# Altium schematic sheet EFR32xG27_BLE_AGR_REF_DES_A00_Sheet2.SchDoc
size 420 x 297 mm
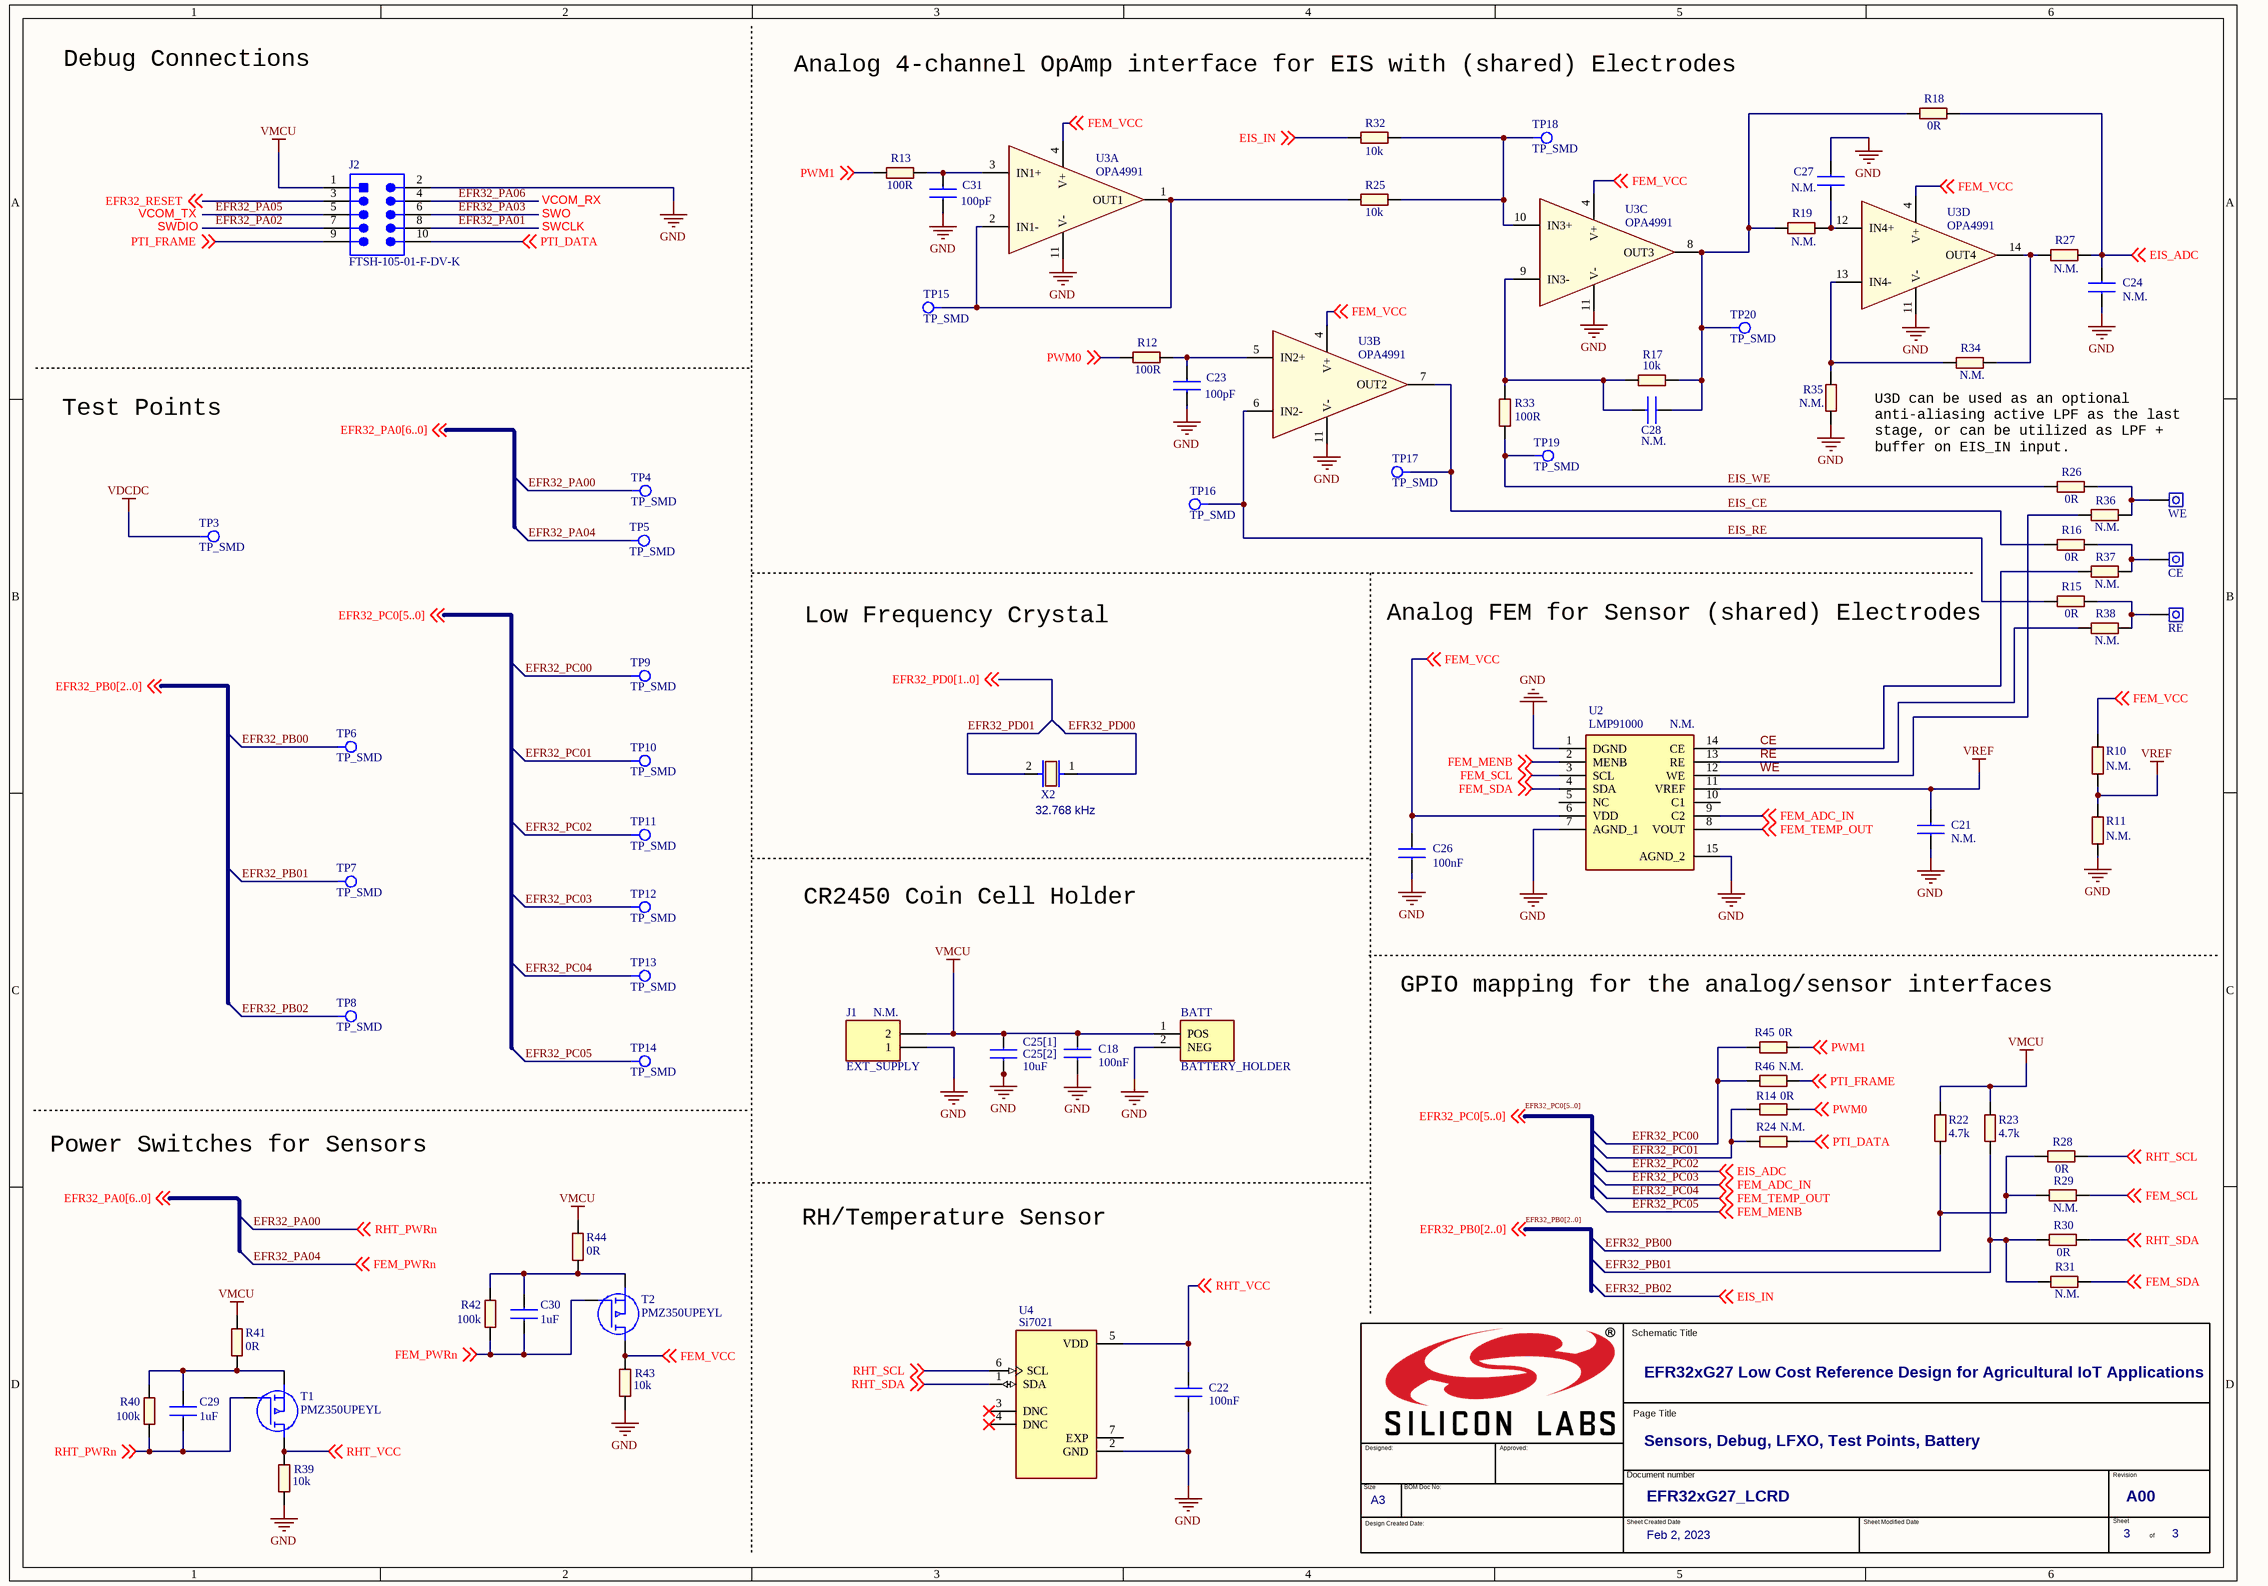
[diagram p0: EFR32xG27_BLE_AGR_REF_DES_A00_Sheet2.SchDoc]

## Parts
*?  Page Title: Sensors, Debug, LFXO, Test Points, Battery  Page Size: A3  Title: EFR32xG27 Low Cost Reference Design for Agricultural IoT Applications  Page Number: 3  (hidden comment: TitleBlock_EnergyMicro_A3)  (graphical)
BATT  BATTERY_HOLDER  [Battery_holder_CR2450_SMT_1052]
C18  value 100nF  [0201]
C21  Not Mounted: N.M.  [0201]
C22  value 100nF  [0201]
C23  value 100pF  [0201]
C24  Not Mounted: N.M.  [0201]
C25[1]  value 10uF  [C_0402]
C25[2]  (no value)  [C_0603]
C26  value 100nF  [0201]
C27  Not Mounted: N.M.  [0201]
C28  Not Mounted: N.M.  [0201]
C29  value 1uF  [C_0402]
C30  value 1uF  [C_0402]
C31  value 100pF  [0201]
CE  Sensor Electrode  [Sensor Electrode]  (value not drawn)
J1  EXT_SUPPLY  Not Mounted: N.M.  [Jumper_HDR_2.54mm]
J2  FTSH-105-01-F-DV-K  [SMTC-FTSH-105-01-L-DV-K_V]
R10  Not Mounted: N.M.  [0201]
R11  Not Mounted: N.M.  [0201]
R12  value 100R  [0201]
R13  value 100R  [0201]
R14  value 0R  [0201]
R15  value 0R  [0201]
R16  value 0R  [0201]
R17  value 10k  [0201]
R18  value 0R  [0201]
R19  Not Mounted: N.M.  [0201]
R22  value 4.7k  [0201]
R23  value 4.7k  [0201]
R24  Not Mounted: N.M.  [0201]
R25  value 10k  [0201]
R26  value 0R  [0201]
R27  Not Mounted: N.M.  [0201]
R28  value 0R  [0201]
R29  Not Mounted: N.M.  [0201]
R30  value 0R  [0201]
R31  Not Mounted: N.M.  [0201]
R32  value 10k  [0201]
R33  value 100R  [0201]
R34  Not Mounted: N.M.  [0201]
R35  Not Mounted: N.M.  [0201]
R36  Not Mounted: N.M.  [0201]
R37  Not Mounted: N.M.  [0201]
R38  Not Mounted: N.M.  [0201]
R39  value 10k  [0201]
R40  value 100k  [0201]
R41  value 0R  [0201]
R42  value 100k  [0201]
R43  value 10k  [0201]
R44  value 0R  [0201]
R45  value 0R  [0201]
R46  Not Mounted: N.M.  [0201]
RE  Sensor Electrode  [Sensor Electrode]  (value not drawn)
T1  PMZ350UPEYL  [SOT883_B_FIXED]
T2  PMZ350UPEYL  [SOT883_B_FIXED]
TP3  TP_SMD  [TP]
TP4  TP_SMD  [TP]
TP5  TP_SMD  [TP]
TP6  TP_SMD  [TP]
TP7  TP_SMD  [TP]
TP8  TP_SMD  [TP]
TP9  TP_SMD  [TP]
TP10  TP_SMD  [TP]
TP11  TP_SMD  [TP]
TP12  TP_SMD  [TP]
TP13  TP_SMD  [TP]
TP14  TP_SMD  [TP]
TP15  TP_SMD  [TP]
TP16  TP_SMD  [TP]
TP17  TP_SMD  [TP]
TP18  TP_SMD  [TP]
TP19  TP_SMD  [TP]
TP20  TP_SMD  [TP]
U2  LMP91000  Not Mounted: N.M.  [SON50P400X400X80-15N]
U3  OPA4991  [SOP65P640X120-14N]  (parts A,B,C,D of 4)
U4  Si7021  [SON100P300X300X121-7N]
WE  Sensor Electrode  [Sensor Electrode]  (value not drawn)
X2  32.768 kHz  [LFXO]

## Nets
GND: BATT.2(NEG) C18.2 C21.2 C22.2 C23.2 C24.2 C25[1].2 C25[2].2 C26.2 C27.1 C31.2 J1.1 J2.2 R11.1 R35.1 R39.1 R43.1 U2.1(DGND) U2.7(AGND_1) U2.15(AGND_2) U3.11(V-) U4.2(GND)
VDCDC: TP3.1(TP)
VMCU: BATT.1(POS) C18.1 C25[1].1 C25[2].1 J1.2 J2.1 R22.2 R23.2 R41.2 R44.2
VREF: C21.1 R10.1 R11.2 U2.11(VREF)
CE: R37.1 U2.14(CE)
EFR32_PA00: C29.2 R40.1 T1.G TP4.1(TP) ; off-sheet RHT_PWRn  [also labelled RHT_PWRn]
EFR32_PA01: J2.8
EFR32_PA02: J2.7
EFR32_PA03: J2.6
EFR32_PA04: C30.2 R42.1 T2.G TP5.1(TP) ; off-sheet FEM_PWRn  [also labelled FEM_PWRn]
EFR32_PA05: J2.5
EFR32_PA06: J2.4
EFR32_PB00: R22.1 R28.1 R29.1 TP6.1(TP)
EFR32_PB01: R23.1 R30.1 R31.1 TP7.1(TP)
EFR32_PB02: R32.1 TP8.1(TP) ; off-sheet EIS_IN  [also labelled EIS_IN]
EFR32_PC00: R45.1 R46.1 TP9.1(TP)
EFR32_PC01: R14.1 R24.1 TP10.1(TP)
EFR32_PC02: C24.1 R18.2 R27.2 TP11.1(TP) ; off-sheet EIS_ADC  [also labelled EIS_ADC]
EFR32_PC03: TP12.1(TP) U2.9(C2) ; off-sheet FEM_ADC_IN  [also labelled FEM_ADC_IN]
EFR32_PC04: TP13.1(TP) U2.8(VOUT) ; off-sheet FEM_TEMP_OUT  [also labelled FEM_TEMP_OUT]
EFR32_PC05: TP14.1(TP) U2.2(MENB) ; off-sheet FEM_MENB  [also labelled FEM_MENB]
EFR32_PD00: X2.1
EFR32_PD01: X2.2
EFR32_RESET: J2.3 ; off-sheet EFR32_RESET
EIS_CE: R16.1 TP17.1(TP) U3.7(OUT2)
EIS_RE: R15.1 TP16.1(TP) U3.6(IN2-)
EIS_WE: R26.1 R33.1 TP19.1(TP)
FEM_SCL: R29.2 U2.3(SCL) ; off-sheet FEM_SCL
FEM_SDA: R31.2 U2.4(SDA) ; off-sheet FEM_SDA
FEM_VCC: C26.1 R10.2 R43.2 T2.D U2.6(VDD) U3.4(V+) ; off-sheet FEM_VCC
PTI_DATA: J2.10 R24.2 ; off-sheet PTI_DATA
PTI_FRAME: J2.9 R46.2 ; off-sheet PTI_FRAME
PWM0: R12.1 R14.2 ; off-sheet PWM0
PWM1: R13.1 R45.2 ; off-sheet PWM1
RE: R38.1 U2.13(RE)
RHT_SCL: R28.2 U4.6(SCL) ; off-sheet RHT_SCL
RHT_SDA: R30.2 U4.1(SDA) ; off-sheet RHT_SDA
RHT_VCC: C22.1 R39.2 T1.D U4.5(VDD) ; off-sheet RHT_VCC
WE: R36.1 U2.12(WE)
NetC23_1: C23.1 R12.2 U3.5(IN2+)
NetC27_2: C27.2 R19.2 U3.12(IN4+)
NetC28_1: C28.1 R17.1 R33.2 U3.9(IN3-)
NetC28_2: C28.2 R17.2 R18.1 R19.1 TP20.1(TP) U3.8(OUT3)
NetC29_1: C29.1 R40.2 R41.1 T1.S
NetC30_1: C30.1 R42.2 R44.1 T2.S
NetC31_1: C31.1 R13.2 U3.3(IN1+)
NetCE_1: CE.1 R16.2 R37.2
NetR15_2: R15.2 R38.2 RE.1
NetR25_1: R25.1 TP15.1(TP) U3.1(OUT1) U3.2(IN1-)
NetR25_2: R25.2 R32.2 TP18.1(TP) U3.10(IN3+)
NetR26_2: R26.2 R36.2 WE.1
NetR27_1: R27.1 R34.2 U3.14(OUT4)
NetR34_1: R34.1 R35.2 U3.13(IN4-)

Not connected (* = marked no-connect by the designer): U2 5(NC) 10(C1); U4 3(DNC)* 4(DNC)* 7(EXP)

## Buses and harness runs
bus EFR32_PB0[2..0]
bus EFR32_PC0[5..0]

## Notes on the sheet
- Debug Connections
- Analog 4-channel OpAmp interface for EIS with (shared) Electrodes
- VCOM_TX
- SWDIO
- VCOM_RX
- SWO
- SWCLK
- Test Points
- U3D can be used as an optional anti-aliasing active LPF as the last stage, or can be utilized as LPF + buffer on EIS_IN input.
- Low Frequency Crystal
- Analog FEM for Sensor (shared) Electrodes
- CR2450 Coin Cell Holder
- (near R45) GPIO mapping for the analog/sensor interfaces
- Power Switches for Sensors
- RH/Temperature Sensor
- Feb 2, 2023
- EFR32xG27_LCRD
- A00
- Labels drawn without touching a wire or pin: EFR32_PB0[2..0], EFR32_PC0[5..0]
- (in symbol TitleBlock_EnergyMicro_A3) Schematic Title; Page Title; Designed:; Approved:; Document number; Revision; Size; BOM Doc No:; Design Created Date:; Sheet Created Date; Sheet Modified Date; Sheet; of

## Library data of the parts
*? = TitleBlock_EnergyMicro_A3: OrgName: Silicon Labs; Page Count: 3
BATT = 1052TR: 2450 SMT battery holder 1052; Manufacturer: Keystone Electronics Corp.; Part Number: 1052TR
C18 C22 C26 = C0201: Ceramic capacitor; Manufacturer: Murata; Part Number: GRM033R61E104ME14; Rating: 25V; Tolerance: 20%; Technology: X5R; Package: SMD0201
C21 = C0201: Ceramic capacitor; Manufacturer: Murata; Part Number: GRM033R61E104ME14; Rating: 25V; Tolerance: 20%; Value: 100nF; Technology: X5R; Package: SMD0201
C23 C31 = C0201: Ceramic capacitor; Manufacturer: Murata; Part Number: GRM033R61E101KA01; Rating: 25V; Tolerance: 10%; Technology: X5R; Package: SMD0201
C24 = C0201: Ceramic capacitor; Manufacturer: Murata; Rating: 25V; Tolerance: 20%; Technology: X5R; Package: SMD0201
C25[1] = C0201: Ceramic capacitor; Manufacturer: Murata; Part Number: GRM155R61C105MA12; Rating: 6.3V; Tolerance: 20%; Technology: X5R; Package: SMD0402
C25[2] = C0201: Ceramic capacitor; Manufacturer: Murata; Part Number: GRM188R61A106MAAL; Rating: 10V; Tolerance: 20%; Not Mounted: N.M.; Value: 10uF; Technology: X5R; Package: SMD0603
C27 C28 = C0201: Ceramic capacitor; Manufacturer: Murata; Rating: 25V; Tolerance: 5%; Technology: C0G; Package: SMD0201
C29 C30 = C0201: Ceramic capacitor; Manufacturer: Murata; Part Number: GRM155R61C105MA12; Rating: 16V; Tolerance: 20%; Technology: X5R; Package: SMD0402
CE RE WE = Sensor Electrode: Footprint for external sensor electrode
J1 = HTSW-102-28-F-S: CONN HEADER VERT 2POS 2.54MM; Part Number: 75160-101-02LF; Manufacturer: Amphenol ICC (FCI)
J2 = CMP-2000-05352-1: 10-pin mini-simplicity header; Manufacturer: Samtec; Part Number: FTSH-105-01-L-DV-K; Package: Male Header, Pitch 1.27 mm, 2 x 5 Position
R10 R11 R24 R29 R31 R36-R38 R46 = R0201: zero ohm resistor; Manufacturer: Any; Value: 0R
R12-R19 R22 R23 R25-R28 R30 R32-R35 R39-R45 = R0201: zero ohm resistor; Manufacturer: Any
T1 T2 = PMZ350UPEYL: P-Channel Trench MOSFET 20V 1A (Ta) 360mW (Ta), 3.125W (Tc) Surface Mount DFN1006-3; Manufacturer: Nexperia; Rating: 30V; Package: SOT-883; Part Number: PMZ350UPEYL
U2 = LMP91000SDE: Analog AFE Integrated Circuit; Manufacturer: Texas Instruments; Part Number: LMP91000SDE; Package: 14-Pin WSON
U3 = OPA4991_4-ch: 4-channel OpAmp Integrated Circuit; Manufacturer: Texas Instruments; Part Number: OPA4991IPWR; Package: 14-pin TSSOP
U4 = SI7021-A10-GM: Board Mount Humidity and Temperature sensor; Manufacturer: Silicon Labs; Part Number: Si7021-A10-GM; Package: DFN-6 Silicon Labs
X2 = LFXO: 32.768 kHz low frequency crystal; Part Number: CM8V-T1A; Manufacturer: Micro Crystal AG; Tolerance: 20ppm; Load capacitance: 7pF